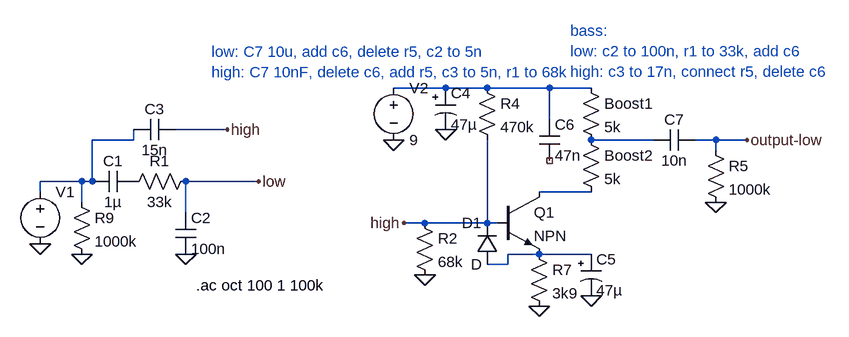
[diagram p0: schematic Rangemaster (hi-lo).asc]
Rangemaster (hi-lo).asc, the LTspice schematic file:
Version 4
SHEET 1 1164 680
WIRE 560 112 480 112
WIRE 624 112 560 112
WIRE 720 112 624 112
WIRE 784 112 720 112
WIRE 720 160 720 112
WIRE 224 176 144 176
WIRE 80 192 80 176
WIRE 80 192 16 192
WIRE 880 192 784 192
WIRE 976 192 944 192
WIRE 1024 192 976 192
WIRE 976 208 976 192
WIRE 0 256 -64 256
WIRE 16 256 16 192
WIRE 16 256 0 256
WIRE 272 256 160 256
WIRE -64 272 -64 256
WIRE 784 272 704 272
WIRE 0 288 0 256
WIRE 160 304 160 256
WIRE 528 320 496 320
WIRE 624 320 624 192
WIRE 624 320 528 320
WIRE 640 320 624 320
WIRE 704 368 656 368
WIRE 784 368 704 368
WIRE 656 384 656 368
WIRE 656 384 624 384
FLAG -64 352 0
FLAG 160 368 0
FLAG 272 256 low
FLAG 224 176 high
FLAG 480 192 0
FLAG 704 448 0
FLAG 784 432 0
FLAG 560 176 0
FLAG 528 400 0
FLAG 0 368 0
FLAG 496 320 high
FLAG 1024 192 output-low
FLAG 976 288 0
SYMBOL voltage -64 256 R0
SYMATTR InstName V1
SYMATTR Value ""
SYMATTR Value2 AC 1
SYMBOL cap 80 240 R90
WINDOW 0 0 32 VBottom 2
WINDOW 3 32 32 VTop 2
SYMATTR InstName C1
SYMATTR Value 1µ
SYMBOL res 176 240 R90
WINDOW 0 0 56 VBottom 2
WINDOW 3 32 56 VTop 2
SYMATTR InstName R1
SYMATTR Value 33k
SYMBOL cap 144 304 R0
SYMATTR InstName C2
SYMATTR Value 100n
SYMBOL cap 144 160 R90
WINDOW 0 0 32 VBottom 2
WINDOW 3 32 32 VTop 2
SYMATTR InstName C3
SYMATTR Value 15n
SYMBOL voltage 480 96 R0
SYMATTR InstName V2
SYMATTR Value 9
SYMBOL polcap 544 112 R0
SYMATTR InstName C4
SYMATTR Value 47µ
SYMBOL res 608 96 R0
SYMATTR InstName R4
SYMATTR Value 470k
SYMBOL npn 640 272 R0
SYMATTR InstName Q1
SYMBOL res 688 352 R0
SYMATTR InstName R7
SYMATTR Value 3k9
SYMBOL polcap 768 368 R0
SYMATTR InstName C5
SYMATTR Value 47µ
SYMBOL diode 640 384 R180
WINDOW 0 24 64 Left 2
WINDOW 3 24 0 Left 2
SYMATTR InstName D1
SYMBOL res 512 304 R0
SYMATTR InstName R2
SYMATTR Value 68k
SYMBOL res -16 272 R0
SYMATTR InstName R9
SYMATTR Value 1000k
SYMBOL cap 704 160 R0
SYMATTR InstName C6
SYMATTR Value 47n
SYMBOL res 768 96 R0
SYMATTR InstName Boost1
SYMATTR Value 5k
SYMBOL res 768 176 R0
SYMATTR InstName Boost2
SYMATTR Value 5k
SYMBOL cap 944 176 R90
WINDOW 0 0 32 VBottom 2
WINDOW 3 32 32 VTop 2
SYMATTR InstName C7
SYMATTR Value 10n
SYMBOL res 960 192 R0
SYMATTR InstName R5
SYMATTR Value 1000k
TEXT 176 416 Left 2 !.ac oct 100 1 100k
TEXT 200 56 Left 2 ;low: C7 10u, add c6, delete r5, c2 to 5n\nhigh: C7 10nF, delete c6, add r5, c3 to 5n, r1 to 68k
TEXT 752 24 Left 2 ;bass:\nlow: c2 to 100n, r1 to 33k, add c6\nhigh: c3 to 17n, connect r5, delete c6

The netlist it stands for:
* Rangemaster (hi-lo).asc
V1 N002 0 AC 1
C1 P001 N002 1µ
R1 low P001 33k
C2 low 0 100n
C3 high N002 15n
V2 N001 0 9
C4 N001 0 47µ
R4 N001 high 470k
Q1 N004 high N005 0 NPN
R7 N005 0 3k9
C5 N005 0 47µ
D1 N005 high D
R2 high 0 68k
R9 N002 0 1000k
C6 N001 NC_01 47n
R§Boost1 N001 N003 5k
R§Boost2 N003 N004 5k
C7 output-low N003 10n
R5 output-low 0 1000k
.model D D
.lib standard.dio
.model NPN NPN
.model PNP PNP
.lib standard.bjt
.ac oct 100 1 100k
* low: C7 10u, add c6, delete r5, c2 to 5n
* high: C7 10nF, delete c6, add r5, c3 to 5n, r1 to 68k
* bass:
* low: c2 to 100n, r1 to 33k, add c6
* high: c3 to 17n, connect r5, delete c6
.backanno
.end